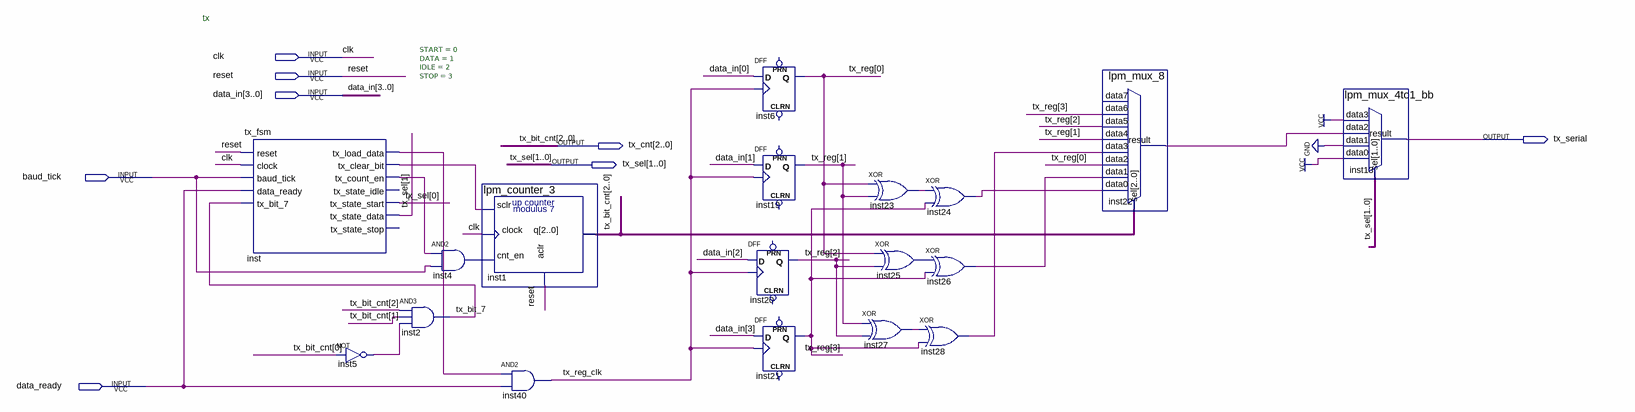
[diagram p0: schematic sheet]
// Quartus schematic tx.bdf as structural Verilog: 18 symbols, 8 pins
module tx (
  input  clk,
  input  reset,
  input  [3:0] data_in,
  input  baud_tick,
  input  data_ready,
  output tx_serial,
  output [2:0] tx_cnt,
  output [1:0] tx_sel
);

  wire inst4_out, inst5_out, inst22_result, inst23_out, inst24_out, inst25_out, inst26_out, inst27_out,
       inst28_out, inst_tx_clear_bit, inst_tx_count_en, inst_tx_load_data, tx_bit_7, tx_reg_clk;
  wire [3:0] tx_reg;

  tx_fsm #(.START(0), .DATA(1), .IDLE(2), .STOP(3)) inst (
    .reset(reset), .clock(clk), .baud_tick(baud_tick), .data_ready(data_ready), .tx_bit_7(tx_bit_7),
    .tx_load_data(inst_tx_load_data), .tx_clear_bit(inst_tx_clear_bit), .tx_count_en(inst_tx_count_en),
    .tx_state_start(tx_sel[0]), .tx_state_data(tx_sel[1]));  // open: tx_state_idle, tx_state_stop
  not inst5 (inst5_out, tx_cnt[0]);
  and inst4 (inst4_out, inst_tx_count_en, baud_tick);
  and inst2 (tx_bit_7, tx_cnt[2], tx_cnt[1], inst5_out);
  lpm_counter_3 inst1 (.sclr(inst_tx_clear_bit), .clock(clk), .cnt_en(inst4_out), .aclr(reset), .q(tx_cnt));
  and inst40 (tx_reg_clk, inst_tx_load_data, data_ready);
  DFF inst20 (.CLK(tx_reg_clk), .D(data_in[2]), .Q(tx_reg[2]));  // open: CLRN, PRN
  DFF inst6 (.CLK(tx_reg_clk), .D(data_in[0]), .Q(tx_reg[0]));  // open: CLRN, PRN
  DFF inst19 (.CLK(tx_reg_clk), .D(data_in[1]), .Q(tx_reg[1]));  // open: CLRN, PRN
  DFF inst21 (.CLK(tx_reg_clk), .D(data_in[3]), .Q(tx_reg[3]));  // open: CLRN, PRN
  xor inst23 (inst23_out, tx_reg[0], tx_reg[1]);
  xor inst25 (inst25_out, tx_reg[0], tx_reg[2]);
  xor inst27 (inst27_out, tx_reg[1], tx_reg[2]);
  xor inst24 (inst24_out, inst23_out, tx_reg[3]);
  xor inst26 (inst26_out, inst25_out, tx_reg[3]);
  xor inst28 (inst28_out, inst27_out, tx_reg[3]);
  lpm_mux_8 inst22 (
    .data6(tx_reg[3]), .data5(tx_reg[2]), .data4(tx_reg[1]), .data3(inst28_out), .data2(tx_reg[0]),
    .data1(inst26_out), .data0(inst24_out), .sel(tx_cnt), .result(inst22_result));  // open: data7
  lpm_mux_4to1_bb inst13 (
    .data3(1'b1), .data2(inst22_result), .data1(1'b0), .data0(1'b1), .sel(tx_sel), .result(tx_serial));

  // Other names for the same wires on the sheet: tx_bit_cnt[2:0] = tx_cnt

  // Notes on the sheet:
  //   tx
endmodule
